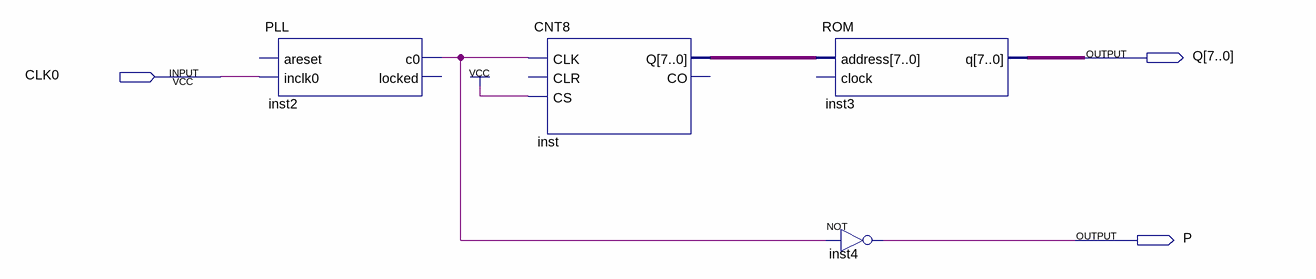
[diagram p0: schematic sheet]
// Quartus schematic SINE.bdf as structural Verilog: 4 symbols, 3 pins
module SINE (
  input  CLK0,
  output [7:0] Q,
  output P
);

  wire inst2_c0;
  wire [7:0] inst_q;

  PLL inst2 (.inclk0(CLK0), .c0(inst2_c0));  // open: areset, locked
  CNT8 inst (.CLK(inst2_c0), .CS(1'b1), .Q(inst_q));  // open: CLR, CO
  ROM inst3 (.address(inst_q), .q(Q));  // open: clock
  not inst4 (P, inst2_c0);
endmodule
